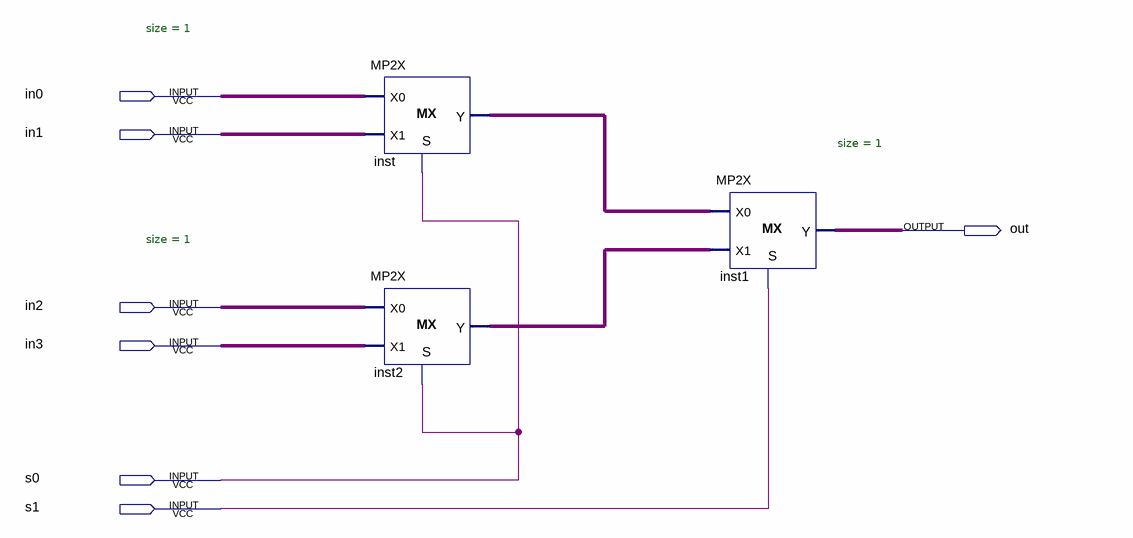
[diagram p0: schematic sheet]
// Quartus schematic MX4x1.bdf as structural Verilog: 3 symbols, 7 pins
module MX4x1 (
  input  in0,
  input  in1,
  input  in2,
  input  in3,
  input  s0,
  input  s1,
  output out
);

  wire inst2_y, inst_y;

  MP2X #(.size(1)) inst (.S(s0), .X0(in0), .X1(in1), .Y(inst_y));
  MP2X #(.size(1)) inst2 (.S(s0), .X0(in2), .X1(in3), .Y(inst2_y));
  MP2X #(.size(1)) inst1 (.S(s1), .X0(inst_y), .X1(inst2_y), .Y(out));
endmodule
